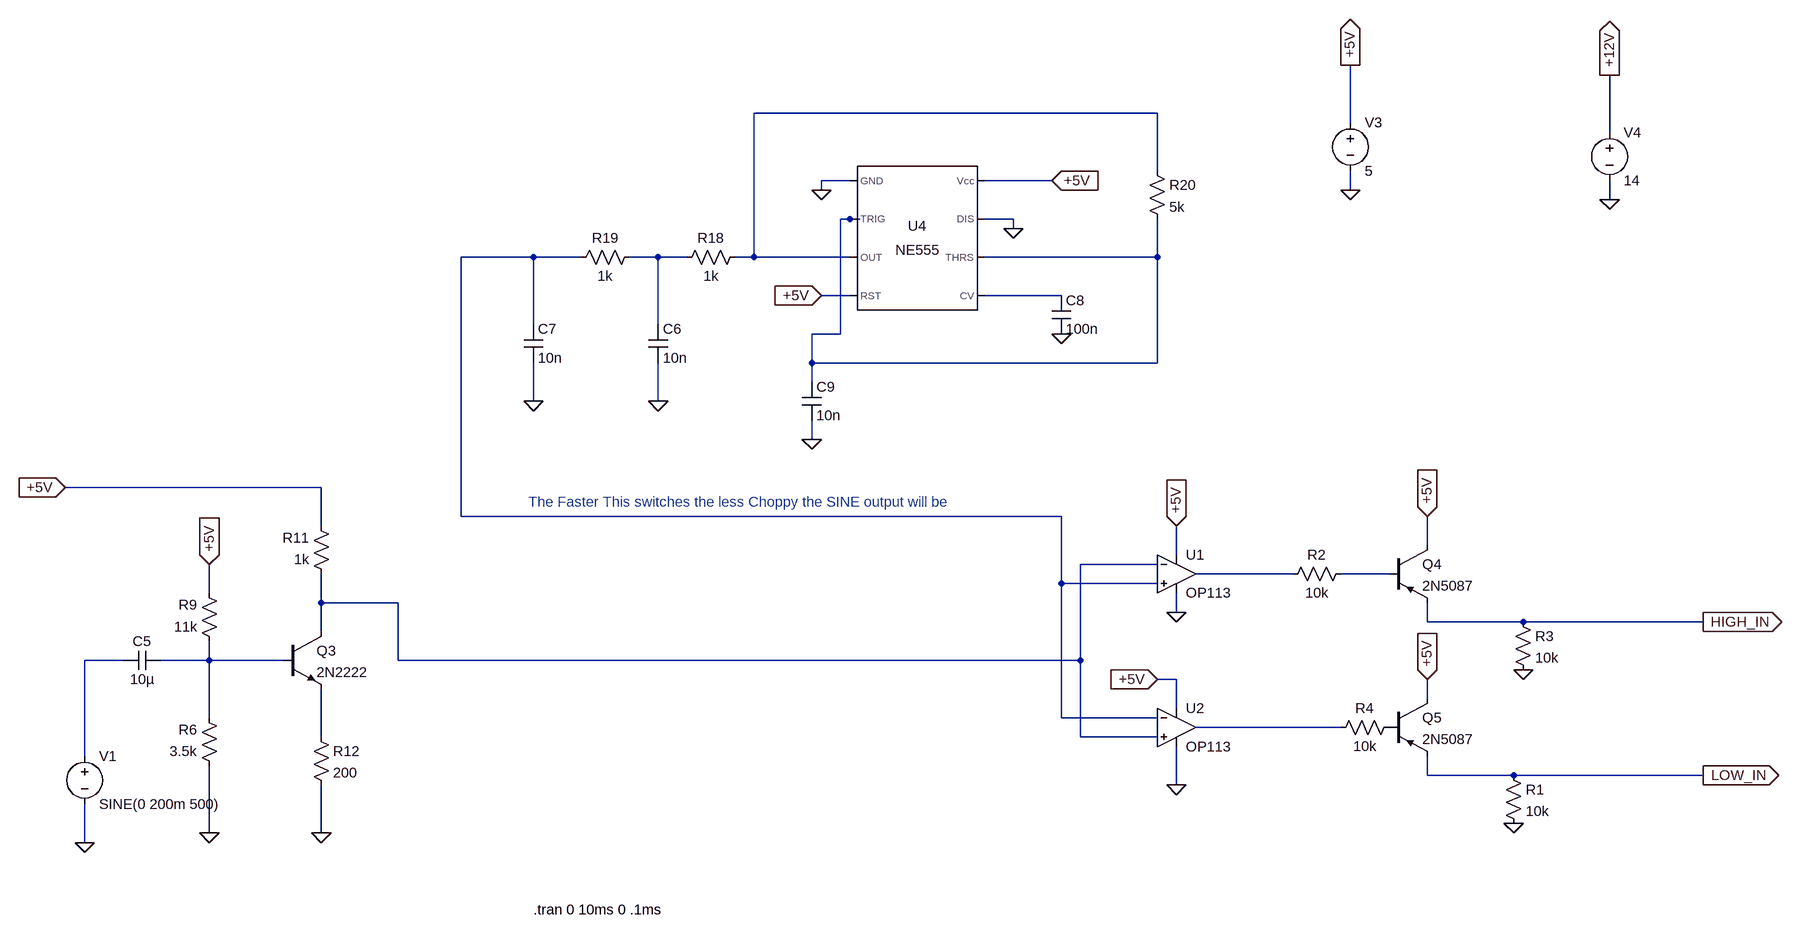
[diagram p0: schematic comparatorCircuit_draft.asc]
comparatorCircuit_draft.asc, the LTspice schematic file:
Version 4
SHEET 1 6296 840
WIRE 3760 -880 3088 -880
WIRE 4112 -864 4112 -960
WIRE 4544 -848 4544 -944
WIRE 3760 -784 3760 -880
WIRE 3248 -768 3200 -768
WIRE 3584 -768 3472 -768
WIRE 3200 -752 3200 -768
WIRE 4112 -752 4112 -784
WIRE 4544 -736 4544 -768
WIRE 3248 -704 3232 -704
WIRE 3264 -704 3248 -704
WIRE 3520 -704 3472 -704
WIRE 3520 -688 3520 -704
WIRE 2720 -640 2304 -640
WIRE 2800 -640 2720 -640
WIRE 2928 -640 2880 -640
WIRE 2976 -640 2928 -640
WIRE 3088 -640 3088 -880
WIRE 3088 -640 3056 -640
WIRE 3248 -640 3088 -640
WIRE 3760 -640 3760 -704
WIRE 3760 -640 3472 -640
WIRE 3248 -576 3200 -576
WIRE 3600 -576 3472 -576
WIRE 2720 -528 2720 -640
WIRE 2928 -528 2928 -640
WIRE 3232 -512 3232 -704
WIRE 3232 -512 3184 -512
WIRE 3184 -464 3184 -512
WIRE 3760 -464 3760 -640
WIRE 3760 -464 3184 -464
WIRE 3184 -432 3184 -464
WIRE 2720 -400 2720 -464
WIRE 2928 -400 2928 -464
WIRE 3184 -336 3184 -368
WIRE 1648 -256 1088 -256
WIRE 2304 -208 2304 -640
WIRE 3600 -208 2304 -208
WIRE 1648 -192 1648 -256
WIRE 4240 -160 4240 -208
WIRE 3792 -144 3792 -192
WIRE 3760 -128 3632 -128
WIRE 4016 -112 3824 -112
WIRE 4176 -112 4096 -112
WIRE 3600 -96 3600 -208
WIRE 3760 -96 3600 -96
WIRE 1328 -80 1328 -128
WIRE 1648 -64 1648 -112
WIRE 1776 -64 1648 -64
WIRE 3792 -48 3792 -80
WIRE 4240 -32 4240 -64
WIRE 4400 -32 4240 -32
WIRE 5072 -32 4400 -32
WIRE 1648 -16 1648 -64
WIRE 1184 32 1120 32
WIRE 1328 32 1328 0
WIRE 1328 32 1248 32
WIRE 1584 32 1328 32
WIRE 1776 32 1776 -64
WIRE 3632 32 3632 -128
WIRE 3632 32 1776 32
WIRE 3792 64 3760 64
WIRE 4240 96 4240 64
WIRE 3792 112 3792 64
WIRE 1328 128 1328 32
WIRE 3600 128 3600 -96
WIRE 3760 128 3600 128
WIRE 4096 144 3824 144
WIRE 1648 160 1648 80
WIRE 3632 160 3632 32
WIRE 3760 160 3632 160
WIRE 1120 192 1120 32
WIRE 4240 224 4240 192
WIRE 4384 224 4240 224
WIRE 5072 224 4384 224
WIRE 3792 240 3792 176
WIRE 1328 320 1328 208
WIRE 1648 320 1648 240
WIRE 1120 336 1120 272
FLAG 1120 336 0
FLAG 1088 -256 +5V
IOPIN 1088 -256 In
FLAG 3760 64 +5V
IOPIN 3760 64 In
FLAG 3792 -192 +5V
IOPIN 3792 -192 In
FLAG 4112 -752 0
FLAG 4112 -960 +5V
IOPIN 4112 -960 Out
FLAG 3200 -752 0
FLAG 3584 -768 +5V
IOPIN 3584 -768 In
FLAG 3792 240 0
FLAG 3792 -48 0
FLAG 2720 -400 0
FLAG 2928 -400 0
FLAG 3600 -512 0
FLAG 3184 -336 0
FLAG 3200 -576 +5V
IOPIN 3200 -576 In
FLAG 4544 -736 0
FLAG 4544 -944 +12V
IOPIN 4544 -944 Out
FLAG 3520 -688 0
FLAG 1328 -128 +5V
IOPIN 1328 -128 In
FLAG 1328 320 0
FLAG 1648 320 0
FLAG 5072 224 LOW_IN
IOPIN 5072 224 Out
FLAG 5072 -32 HIGH_IN
IOPIN 5072 -32 Out
FLAG 4240 -208 +5V
IOPIN 4240 -208 In
FLAG 4400 48 0
FLAG 4384 304 0
FLAG 4240 64 +5V
IOPIN 4240 64 In
SYMBOL voltage 1120 176 R0
WINDOW 123 0 0 Left 0
WINDOW 39 0 0 Left 0
SYMATTR InstName V1
SYMATTR Value SINE(0 200m 500)
SYMBOL npn 1584 -16 R0
SYMATTR InstName Q3
SYMATTR Value 2N2222
SYMBOL res 1344 224 R180
WINDOW 0 36 76 Left 2
WINDOW 3 36 40 Left 2
SYMATTR InstName R6
SYMATTR Value 3.5k
SYMBOL res 1344 16 R180
WINDOW 0 36 76 Left 2
WINDOW 3 36 40 Left 2
SYMATTR InstName R9
SYMATTR Value 11k
SYMBOL res 1664 -96 R180
WINDOW 0 36 76 Left 2
WINDOW 3 36 40 Left 2
SYMATTR InstName R11
SYMATTR Value 1k
SYMBOL res 1632 144 R0
SYMATTR InstName R12
SYMATTR Value 200
SYMBOL cap 1248 16 R90
WINDOW 0 0 32 VBottom 2
WINDOW 3 32 32 VTop 2
SYMATTR InstName C5
SYMATTR Value 10µ
SYMBOL pnp 4176 -160 R0
SYMATTR InstName Q4
SYMATTR Value 2N5087
SYMBOL pnp 4176 96 R0
SYMATTR InstName Q5
SYMATTR Value 2N5087
SYMBOL voltage 4112 -880 R0
WINDOW 123 0 0 Left 0
WINDOW 39 0 0 Left 0
SYMATTR InstName V3
SYMATTR Value 5
SYMBOL Misc\\NE555 3360 -672 R0
SYMATTR InstName U4
SYMBOL res 3072 -656 R90
WINDOW 0 0 56 VBottom 2
WINDOW 3 32 56 VTop 2
SYMATTR InstName R18
SYMATTR Value 1k
SYMBOL res 2896 -656 R90
WINDOW 0 0 56 VBottom 2
WINDOW 3 32 56 VTop 2
SYMATTR InstName R19
SYMATTR Value 1k
SYMBOL cap 2912 -528 R0
SYMATTR InstName C6
SYMATTR Value 10n
SYMBOL cap 2704 -528 R0
SYMATTR InstName C7
SYMATTR Value 10n
SYMBOL cap 3584 -576 R0
SYMATTR InstName C8
SYMATTR Value 100n
SYMBOL cap 3168 -432 R0
SYMATTR InstName C9
SYMATTR Value 10n
SYMBOL res 3744 -800 R0
SYMATTR InstName R20
SYMATTR Value 5k
SYMBOL voltage 4544 -864 R0
WINDOW 123 0 0 Left 0
WINDOW 39 0 0 Left 0
SYMATTR InstName V4
SYMATTR Value 14
SYMBOL Opamps\\OP113 3792 -176 R0
SYMATTR InstName U1
SYMBOL Opamps\\OP113 3792 80 R0
SYMATTR InstName U2
SYMBOL res 4368 208 R0
SYMATTR InstName R1
SYMATTR Value 10k
SYMBOL res 4112 -128 R90
WINDOW 0 0 56 VBottom 2
WINDOW 3 32 56 VTop 2
SYMATTR InstName R2
SYMATTR Value 10k
SYMBOL res 4384 -48 R0
SYMATTR InstName R3
SYMATTR Value 10k
SYMBOL res 4192 128 R90
WINDOW 0 0 56 VBottom 2
WINDOW 3 32 56 VTop 2
SYMATTR InstName R4
SYMATTR Value 10k
TEXT 2720 448 Left 2 !.tran 0 10ms 0 .1ms
TEXT 2712 -232 Left 2 ;The Faster This switches the less Choppy the SINE output will be

The netlist it stands for:
* comparatorCircuit_draft.asc
V1 N009 0 SINE(0 200m 500)
Q3 N006 N010 N012 0 2N2222
R6 0 N010 3.5k
R9 N010 +5V 11k
R11 N006 +5V 1k
R12 N012 0 200
C5 N010 N009 10µ
Q4 +5V N008 HIGH_IN 0 2N5087
Q5 +5V P001 LOW_IN 0 2N5087
V3 +5V 0 5
XU4 0 N002 N001 +5V N005 N002 0 +5V NE555  ; pins GND TRIG OUT RST CV THRS DIS Vcc
R18 N001 N004 1k
R19 N004 N003 1k
C6 N004 0 10n
C7 N003 0 10n
C8 N005 0 100n
C9 N002 0 10n
R20 N001 N002 5k
V4 +12V 0 14
XU1 N003 N006 +5V 0 N007 OP113  ; pins In+ In- V+ V- OUT
XU2 N006 N003 +5V 0 N011 OP113  ; pins In+ In- V+ V- OUT
R1 LOW_IN 0 10k
R2 N008 N007 10k
R3 HIGH_IN 0 10k
R4 P001 N011 10k
.model NPN NPN
.model PNP PNP
.lib standard.bjt
.tran 0 10ms 0 .1ms
* The Faster This switches the less Choppy the SINE output will be
.lib NE555.sub
.lib ADI.lib
.backanno
.end